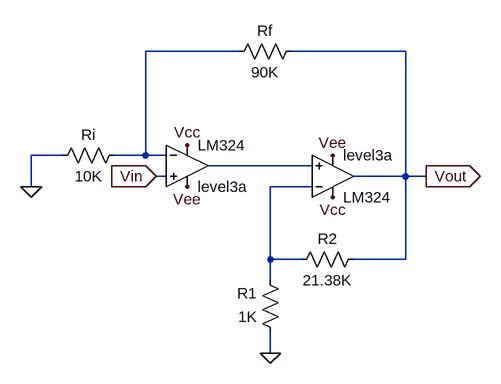
[diagram p0: schematic Circuito1.asc]
Circuito1.asc, the LTspice schematic file:
Version 4.1
SHEET 1 880 680
WIRE 16 -16 -128 -16
WIRE 272 -16 96 -16
WIRE -256 144 -304 144
WIRE -128 144 -128 -16
WIRE -128 144 -176 144
WIRE -96 144 -128 144
WIRE 128 160 -32 160
WIRE -96 176 -112 176
WIRE 272 176 272 -16
WIRE 272 176 192 176
WIRE 304 176 272 176
WIRE -304 192 -304 144
WIRE 128 192 64 192
WIRE 64 304 64 192
WIRE 112 304 64 304
WIRE 272 304 272 176
WIRE 272 304 192 304
WIRE 64 336 64 304
WIRE 64 448 64 416
FLAG 64 448 0
FLAG -304 192 0
FLAG -64 128 Vcc
FLAG 160 208 Vcc
FLAG -64 192 Vee
FLAG 160 144 Vee
FLAG -112 176 Vin
IOPIN -112 176 In
FLAG 304 176 Vout
IOPIN 304 176 Out
SYMBOL OpAmps\\UniversalOpAmp3 -64 160 R0
SYMATTR InstName LM324
SYMBOL OpAmps\\UniversalOpAmp3 160 176 M180
SYMATTR InstName LM324
SYMBOL res -160 128 R90
WINDOW 0 0 56 VBottom 2
WINDOW 3 32 56 VTop 2
SYMATTR InstName Ri
SYMATTR Value 10K
SYMBOL res 112 -32 R90
WINDOW 0 0 56 VBottom 2
WINDOW 3 32 56 VTop 2
SYMATTR InstName Rf
SYMATTR Value 90K
SYMBOL res 208 288 R90
WINDOW 0 0 56 VBottom 2
WINDOW 3 32 56 VTop 2
SYMATTR InstName R2
SYMATTR Value 21.38K
SYMBOL res 80 432 R180
WINDOW 0 36 76 Left 2
WINDOW 3 36 40 Left 2
SYMATTR InstName R1
SYMATTR Value 1K

The netlist it stands for:
* Circuito1.asc
X§LM324 Vin N001 Vcc Vee N002 level3a  ; pins In+ In- V+ V- OUT
X§LM324 N002 N003 Vcc Vee Vout level3a  ; pins In+ In- V+ V- OUT
Ri N001 0 10K
Rf Vout N001 90K
R2 Vout N003 21.38K
R1 0 N003 1K
.backanno
.end